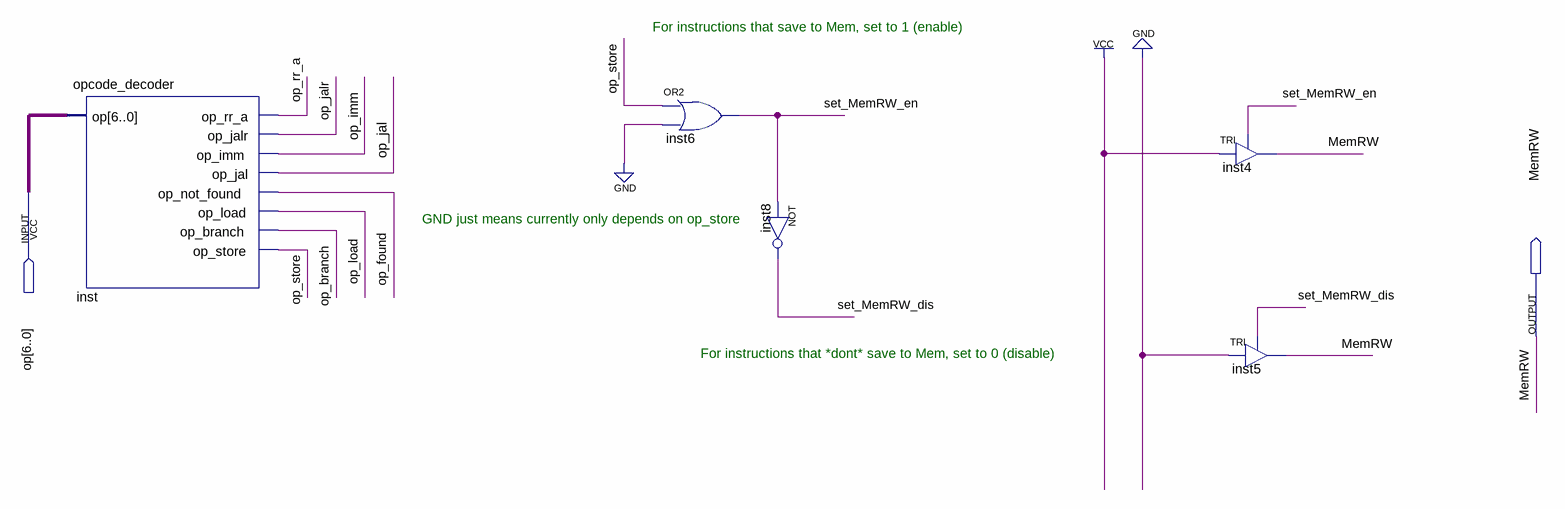
[diagram p0: schematic sheet]
// Quartus schematic MemRW_setter.bdf as structural Verilog: 5 symbols, 2 pins
module MemRW_setter (
  input  [6:0] op,
  output MemRW
);

  wire op_branch, op_found, op_imm, op_jal, op_jalr, op_load, op_rr_a, op_store, set_MemRW_dis, set_MemRW_en;

  opcode_decoder inst (
    .op(op), .op_rr_a(op_rr_a), .op_jalr(op_jalr), .op_imm(op_imm), .op_jal(op_jal), .op_not_found(op_found),
    .op_load(op_load), .op_branch(op_branch), .op_store(op_store));
  or inst6 (set_MemRW_en, op_store, 1'b0);
  not inst8 (set_MemRW_dis, set_MemRW_en);
  TRI inst4 (.IN(1'b1), .OE(set_MemRW_en), .OUT(MemRW));
  TRI inst5 (.IN(1'b0), .OE(set_MemRW_dis), .OUT(MemRW));

  // Notes on the sheet:
  //   For instructions that save to Mem, set to 1 (enable)
  //   GND just means currently only depends on op_store
  //   For instructions that *dont* save to Mem, set to 0 (disable)
endmodule
